# EasyEDA schematic SCH_RailRoadLights_2025-12-05.json
TITLE: Sheet_1; REV: 1.0; Date: 2025-12-03; Sheet: 1/1; Drawn By: kaushikc2008; Company: Your Company
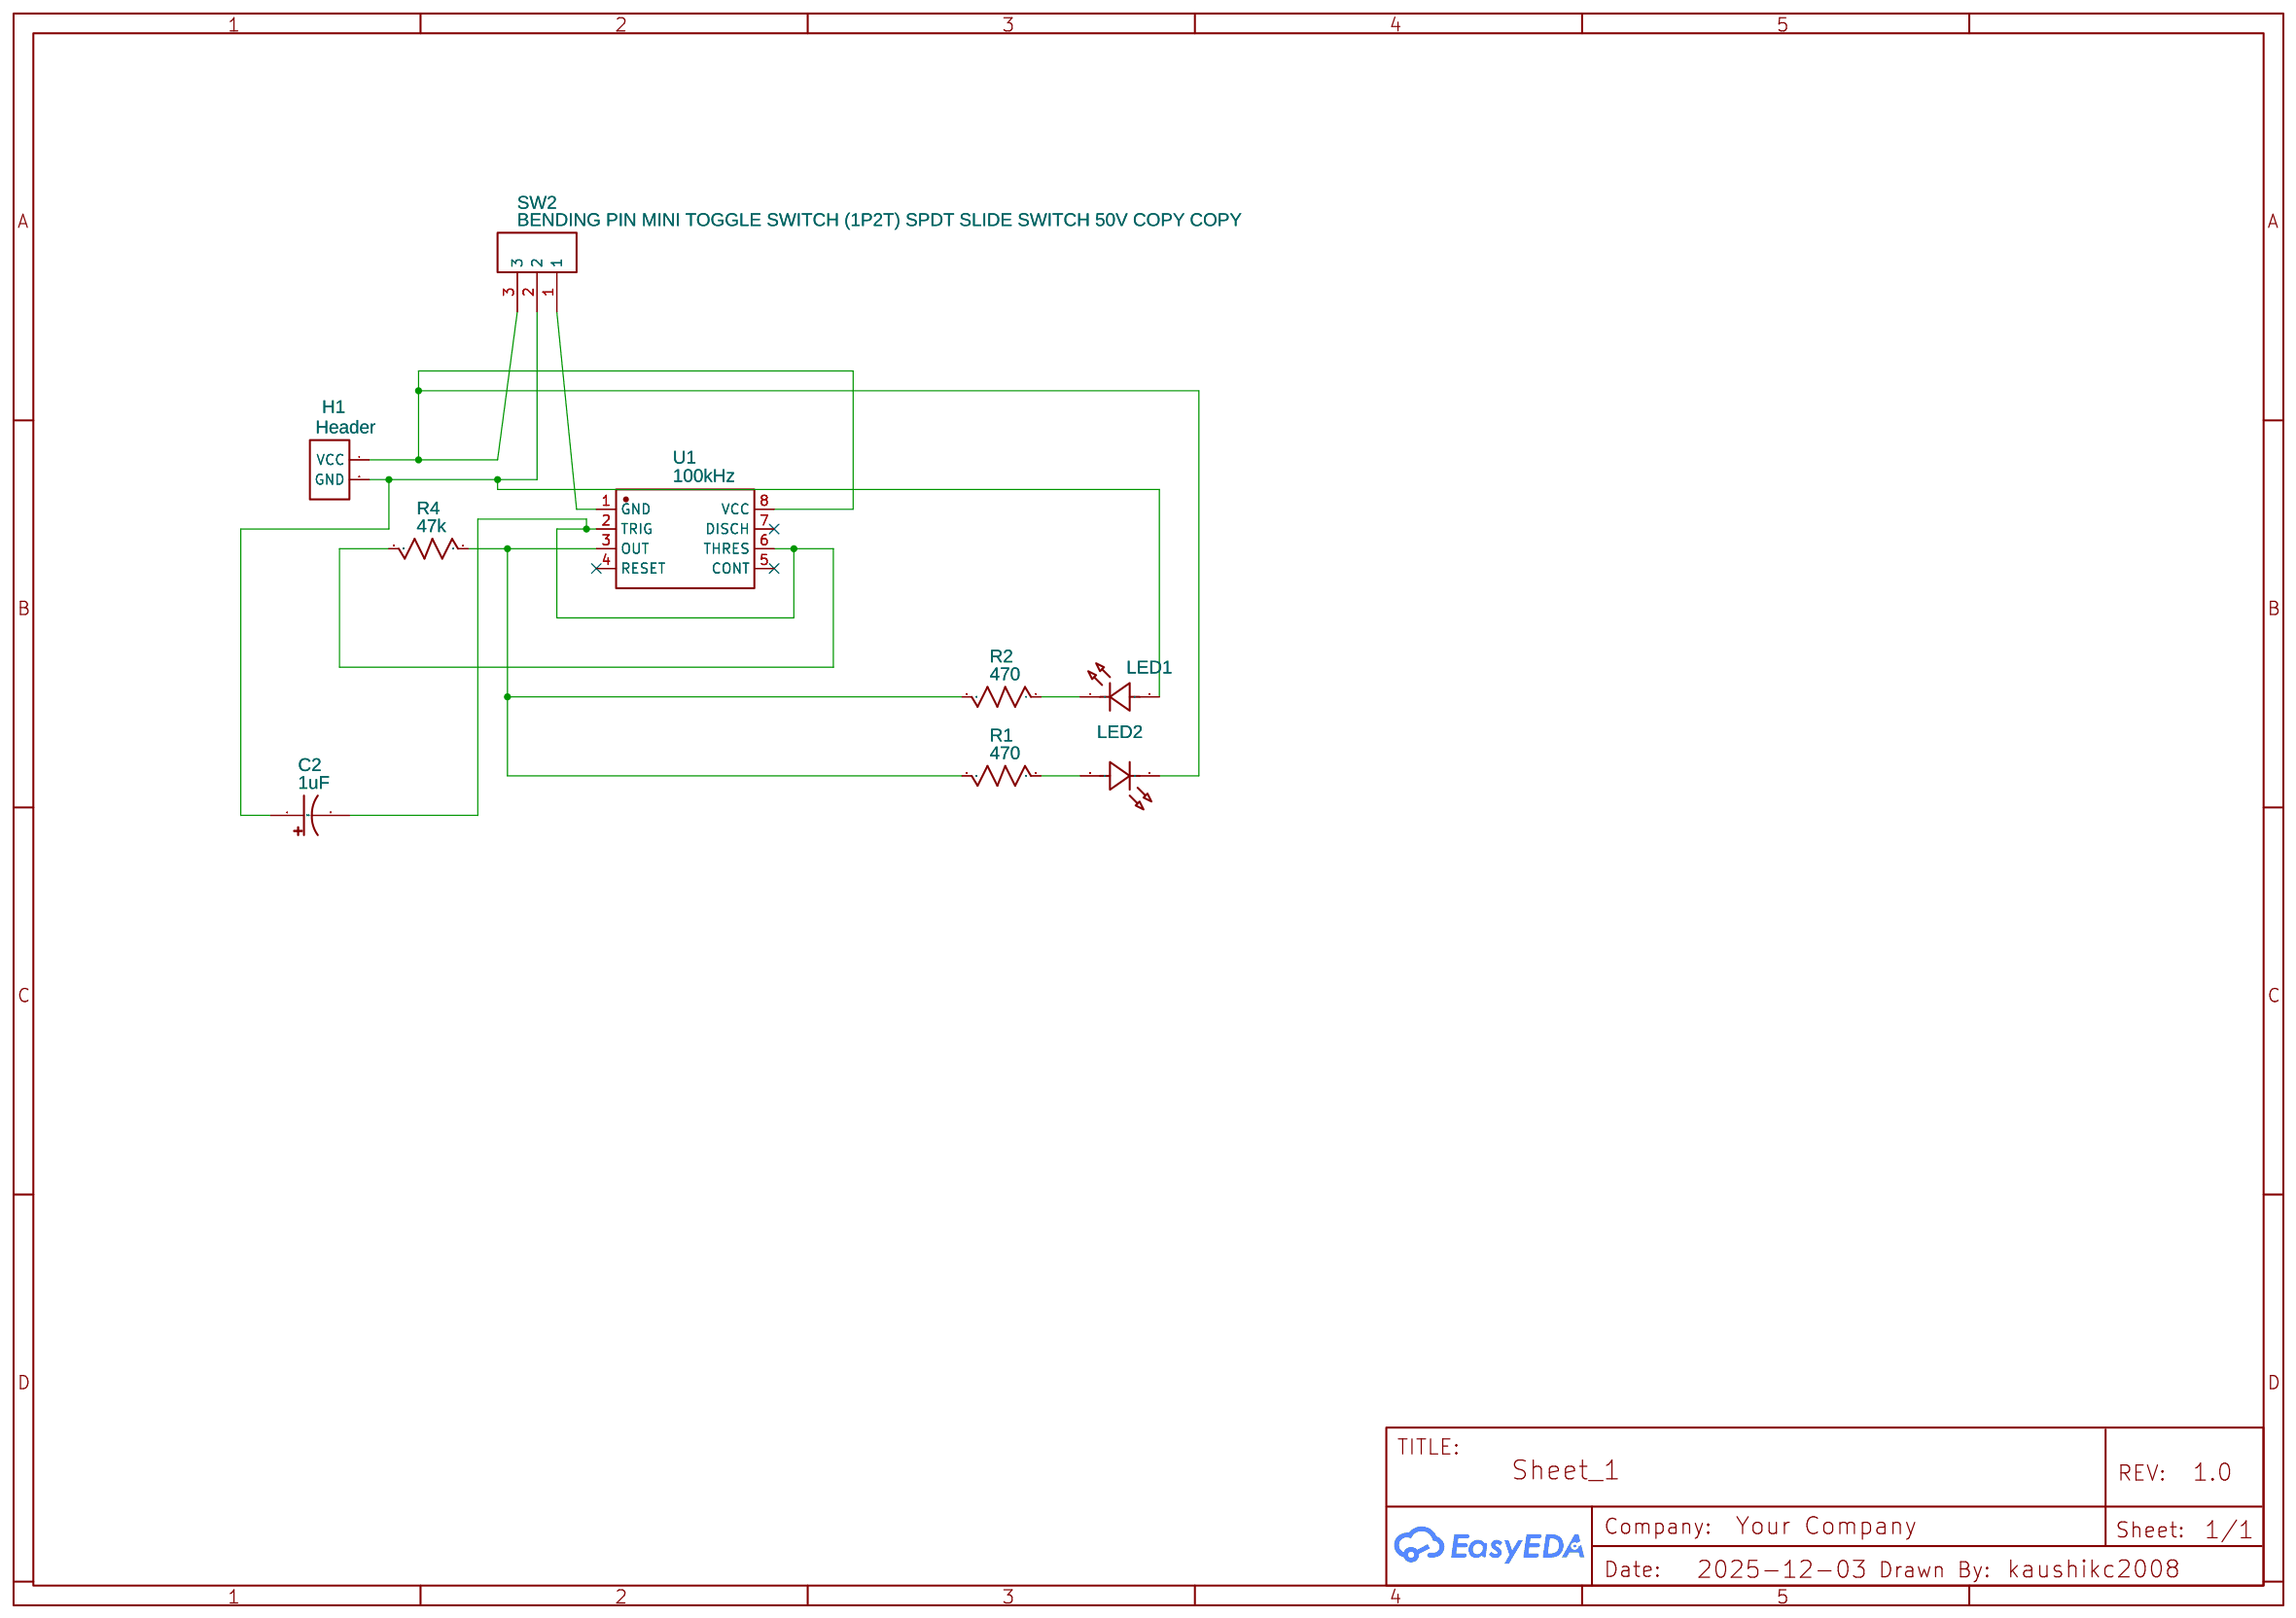
[diagram p0: schematic sheet]

## Parts
C2  1uF  [CAP-TH_BD5.0-P2.00-D0.8-FD]
H1  Header  [HDR-M-2.54_1X2]
LED1  XL-502UWC  [LED-TH_BD5.9-P2.54-RD_WHITE]
LED2  XL-502UWC  [LED-TH_BD5.9-P2.54-RD_WHITE]
R1  470  [R_AXIAL-0.4]
R2  470  [R_AXIAL-0.4]
R4  47k  [R_AXIAL-0.4]
SW2  BENDING PIN MINI TOGGLE SWITCH (1P2T) SPDT SLIDE SWITCH 50V COPY COPY  [BENDING PIN MINI TOGGLE SWITCH (1P2T) SPDT SLIDE SWITCH 50V]
U1  100kHz  [DIP-8_L9.8-W6.6-P2.54-LS7.6-BL]

## Library data of the parts
C2 = UVZ1H010MDD: Contributor: aquawarrior; Supplier: LCSC; Supplier Part: C62934; Manufacturer: Nichicon(尼吉康)
H1 = HEADER-FEMALE-2.54_1X2: Contributor: aquawarrior; Supplier: LCSC; Supplier Part: C492401; Package Display: No
LED1 LED2 = XL-502UWC: Contributor: LCSC; Supplier: LCSC; Supplier Part: C2895480; Manufacturer: XINGLIGHT(成兴光); JLCPCB Part Class: Extended Part
R1 R2 R4 = R_0603_US: Supplier Part: C713997; Supplier: LCSC; Contributor: farizki29; Manufacturer Part: MF1/4W-1KΩ±1%T52; Manufacturer: Huaxing Mechanical-Elec.
SW2 = BENDING PIN MINI TOGGLE SWITCH (1P2T) SPDT SLIDE SWITCH 50V COPY COPY: Manufacturer: Dongguan Kaifeng Electronic Technology Limited; Manufacturer Part: SS12D06; Supplier: Alibaba; Supplier Part: SS12D06; link: https://www.alibaba.com/product-detail/KaiFeng-SS12D06-Three-Wrestling-Pin-Slide_62168688714.html?spm=a2700.7724838.2017115.14.2697ec44KNew8q; Contributor: thommy.morgan; Link: https://www.alibaba.com/product-detail/KaiFeng-SS12D06-Three-Wrestling-Pin-Slide_62168688714.html?spm=a2700.7724838.2017115.14.2697ec44KNew8q; Price: $0.06
U1 = NE555P: Supplier: LCSC; Manufacturer: TI(德州仪器); Supplier Part: C46749; JLCPCB Part Class: Extended Part

## Nets
Net-(C2-1): C2.1 H1.2(GND) LED1.2(A) SW2.2
Net-(C2-2): C2.2 R4.2 U1.2(TRIG) U1.6(THRES)
Net-(H1-1): H1.1(VCC) LED2.1(K) SW2.3 U1.8(VCC)
Net-(LED1-1): LED1.1(K) R2.1
Net-(LED2-2): LED2.2(A) R1.1
Net-(R1-2): R1.2 R2.2 R4.1 U1.3(OUT)
Net-(SW2-1): SW2.1 U1.1(GND)

Not connected (* = marked no-connect by the designer): U1 4(RESET)* 5(CONT)* 7(DISCH)*
